# Altium schematic sheet PROBE 1 CYLINDERS.SchDoc: PROBE 1 CYLINDERS
size 558 x 401 mm; Organization: Carnegie Institution of Washington; DocumentNumber: 4; SheetNumber: 3; SheetTotal: 7; PageSetup: Record=PageOptions|CenterHorizontal=True|CenterVertical=True|PrintScale=0.68|XCorrection=1.00|YCorrection=1.00|PrintKind=0|BorderSize=5000000|LeftOffset=0|BottomOffset=0|Orientation=2|PaperLength=1000|PaperWidth=1000|Scale=100|PaperSource=15|PrintQuality=1200|MediaType=1|DitherType=10|PaperKind=11 x 17|PrintScaleMode=1; DocumentName: CYLINDERS
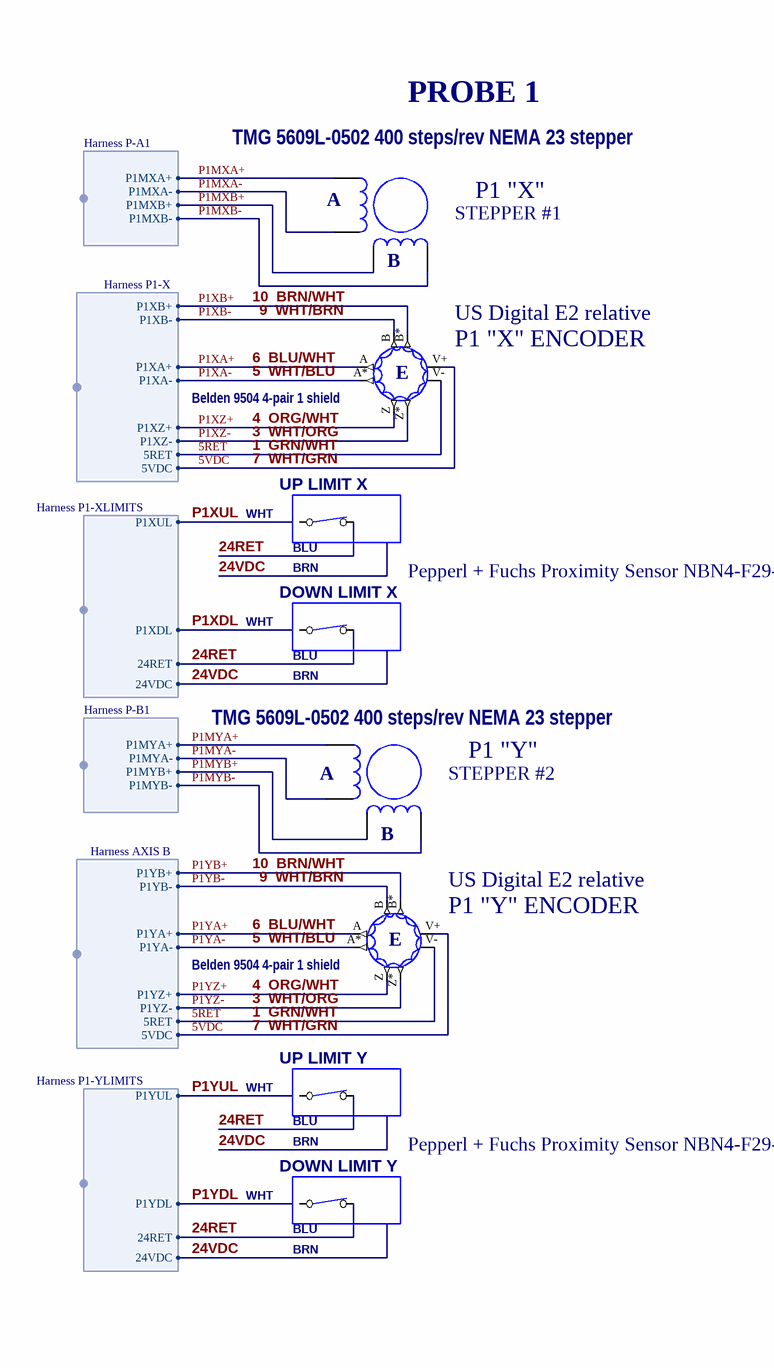
[diagram p0: PROBE 1 CYLINDERS.SchDoc, left]
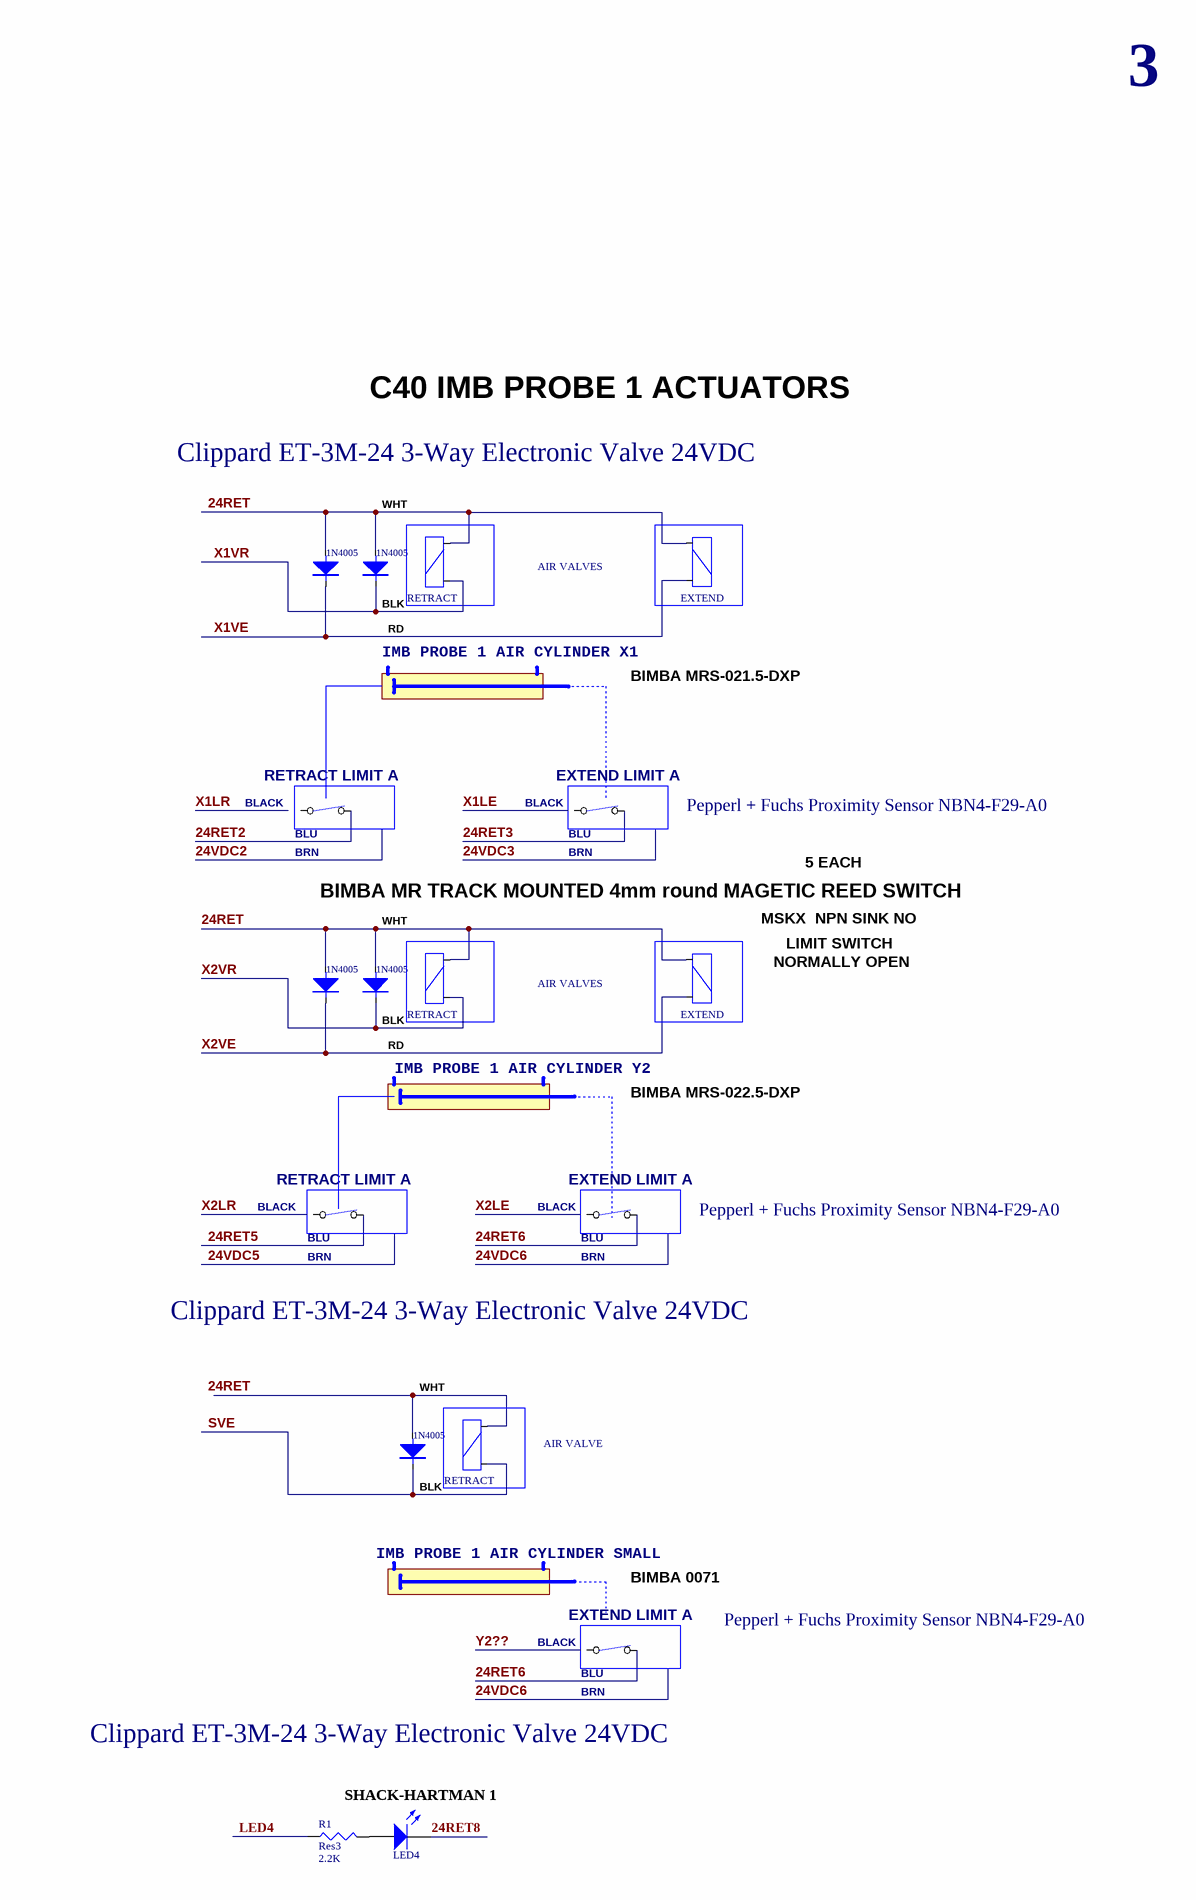
[diagram p1: PROBE 1 CYLINDERS.SchDoc, right]

## Parts
(Parts that share a designator on the sheet are numbered #1, #2 ... from top to bottom, then left to right.)
?#1  RETRACT
?#2  1N4005
?#3  1N4005
?#4  SW-NC2  (value not drawn)
?#5  SW-NC2  (value not drawn)
?#6  SW-NC2  (value not drawn)
?#7  SW-NC2  (value not drawn)
?#8  RETRACT
?#9  1N4005
?#10  1N4005
?#11  SW-NC2  (value not drawn)
?#12  SW-NC2  (value not drawn)
?#13  SW-NC2  (value not drawn)
?#14  RETRACT  S: AIR VALVE
?#15  1N4005
?#16  SW-NC2  (value not drawn)
?#17  SW-NC2  (value not drawn)
AIR_VALVES#1  EXTEND
AIR_VALVES#2  EXTEND
D?  LED4  [LED-0]
IMB_PROBE_1_AIR_CYLINDER_SMALL  (no value)
IMB_PROBE_1_AIR_CYLINDER_X1  (no value)
IMB_PROBE_1_AIR_CYLINDER_Y2  (no value)
P1_"X"  STEPPER #1
P1_"Y"  STEPPER #2
R1  Res3  value 2.2K  [J1-0603]
US_Digital_E2_relative#1  P1 "X" ENCODER
US_Digital_E2_relative#2  P1 "Y" ENCODER

## Harnesses
Harness P1-X: P1XB+, P1XB-, P1XA+, P1XA-, P1XZ+, P1XZ-, 5RET, 5VDC
Harness AXIS B: P1YB+, P1YB-, P1YA+, P1YA-, P1YZ+, P1YZ-, 5RET, 5VDC
Harness P1-XLIMITS: P1XUL, 24RET, 24VDC, P1XDL
Harness P1-YLIMITS: P1YUL, 24RET, 24VDC, P1YDL
Harness P-B1: P1MYA+, P1MYA-, P1MYB+, P1MYB-
Harness P-A1: P1MXA+, P1MXA-, P1MXB+, P1MXB-

## Nets
1  GRN/WHT: US_Digital_E2_relative#1.V- US_Digital_E2_relative#2.V- ; harness Harness P1-X.5RET, harness Harness AXIS B.5RET  [also labelled 5RET]
3  WHT/ORG: US_Digital_E2_relative#1.Z* US_Digital_E2_relative#2.Z* ; harness Harness P1-X.P1XZ-, harness Harness AXIS B.P1YZ-  [also labelled P1XZ-, P1YZ-]
4  ORG/WHT: US_Digital_E2_relative#1.Z US_Digital_E2_relative#2.Z ; harness Harness P1-X.P1XZ+, harness Harness AXIS B.P1YZ+  [also labelled P1XZ+, P1YZ+]
5  WHT/BLU: US_Digital_E2_relative#1.A* US_Digital_E2_relative#2.A* ; harness Harness P1-X.P1XA-, harness Harness AXIS B.P1YA-  [also labelled P1XA-, P1YA-]
5VDC: US_Digital_E2_relative#1.V+ US_Digital_E2_relative#2.V+ ; harness Harness P1-X.5VDC, harness Harness AXIS B.5VDC  [also labelled 7  WHT/GRN]
6  BLU/WHT: US_Digital_E2_relative#1.A US_Digital_E2_relative#2.A ; harness Harness P1-X.P1XA+, harness Harness AXIS B.P1YA+  [also labelled P1XA+, P1YA+]
9  WHT/BRN: US_Digital_E2_relative#1.B US_Digital_E2_relative#2.B ; harness Harness P1-X.P1XB-, harness Harness AXIS B.P1YB-  [also labelled P1XB-, P1YB-]
10  BRN/WHT: US_Digital_E2_relative#1.B* US_Digital_E2_relative#2.B* ; harness Harness P1-X.P1XB+, harness Harness AXIS B.P1YB+  [also labelled P1XB+, P1YB+]
24RET: ?#1.10(-) ?#2.1(A) ?#3.1(A) ?#6.2 ?#7.2 ?#8.10(-) ?#9.1(A) ?#10.1(A) ?#13.2 ?#16.2 AIR_VALVES#1.10(-) AIR_VALVES#2.10(-) ; harness Harness P1-XLIMITS.24RET, harness Harness P1-YLIMITS.24RET
24RET2: ?#4.2
24RET3: ?#5.2
24RET5: ?#11.2
24RET6: ?#12.2 ?#17.2
24RET8: D?.2(K)
24VDC: harness Harness P1-XLIMITS.24VDC, harness Harness P1-YLIMITS.24VDC
LED4: R1.1
P1MXA+: P1_"X".1 ; harness Harness P-A1.P1MXA+
P1MXA-: P1_"X".3 ; harness Harness P-A1.P1MXA-
P1MXB+: P1_"X".4 ; harness Harness P-A1.P1MXB+
P1MXB-: P1_"X".6 ; harness Harness P-A1.P1MXB-
P1MYA+: P1_"Y".1 ; harness Harness P-B1.P1MYA+
P1MYA-: P1_"Y".3 ; harness Harness P-B1.P1MYA-
P1MYB+: P1_"Y".4 ; harness Harness P-B1.P1MYB+
P1MYB-: P1_"Y".6 ; harness Harness P-B1.P1MYB-
P1XDL: harness Harness P1-XLIMITS.P1XDL
P1XUL: harness Harness P1-XLIMITS.P1XUL
P1YDL: harness Harness P1-YLIMITS.P1YDL
P1YUL: harness Harness P1-YLIMITS.P1YUL
SVE: ?#14.2(+) ?#15.2(K)
X1VE: ?#2.2(K) AIR_VALVES#1.2(+)
X1VR: ?#1.2(+) ?#3.2(K)
X2VE: ?#9.2(K) AIR_VALVES#2.2(+)
X2VR: ?#8.2(+) ?#10.2(K)
Net?#14_10: ?#14.10(-) ?#15.1(A)
NetD?_1: D?.1(A) R1.2

Not connected (* = marked no-connect by the designer): ?#4 1; ?#5 1; ?#6 1; ?#7 1; ?#11 1; ?#12 1; ?#13 1; ?#16 1; ?#17 1

## Notes on the sheet
- 3
- C40 IMB PROBE 1 ACTUATORS
- PROBE 1
- Clippard ET-3M-24 3-Way Electronic Valve 24VDC
- (near P1_"X") TMG 5609L-0502 400 steps/rev NEMA 23 stepper
- WHT
- (near P1_"X") A
- BLK
- (near P1_"X") B
- RD
- BIMBA MRS-021.5-DXP
- (near US_Digital_E2_relative#1) Belden 9504 4-pair 1 shield
- RETRACT LIMIT A
- EXTEND LIMIT A
- UP LIMIT X
- BLACK
- BLU
- BRN
- Pepperl + Fuchs Proximity Sensor NBN4-F29-A0
- BIMBA MR TRACK MOUNTED 4mm round MAGETIC REED SWITCH
- 5 EACH
- DOWN LIMIT X
- MSKX  NPN SINK NO
- NORMALLY OPEN
- LIMIT SWITCH
- (near P1_"Y") TMG 5609L-0502 400 steps/rev NEMA 23 stepper
- (near P1_"Y") A
- BIMBA MRS-022.5-DXP
- (near P1_"Y") B
- (near US_Digital_E2_relative#2) Belden 9504 4-pair 1 shield
- UP LIMIT Y
- DOWN LIMIT Y
- BIMBA 0071
- SHACK-HARTMAN 1
- Labels drawn without touching a wire or pin: 24RET
- Carnegie Institution of Washington
- 813 Santa Barbara Street
- The Observatories
- PHONE (626) 577-1122               FAX (626) 795-8136
- Pasadena, California 91101
- Title:
- OCIW
- Size:
- Date:
- C
- Scale:
- Drawn By:
- Checked By:
- A. BAGISH
- alanb
- Revision:
- Sheet          of
- File:
- (in symbol ENCODER DIF) E

## Library data of the parts
?#1 ?#8 ?#14 AIR_VALVES#1 AIR_VALVES#2 = COIL2
?#2 ?#3 ?#9 ?#10 ?#15 = DIODE(SHORT)
D? = LED0: Typical INFRARED GaAs LED; Manuf #: 607-1212-120F; Published: 8-Jun-2000; LatestRevisionDate: 08-Jul-2005; LatestRevisionNote: Mech Layer 1 removed.; PackageReference: LED-0; Publisher: Altium Limited
IMB_PROBE_1_AIR_CYLINDER_SMALL IMB_PROBE_1_AIR_CYLINDER_X1 IMB_PROBE_1_AIR_CYLINDER_Y2 = AIR CYL LONG IN
P1_"X" P1_"Y" = MOTOR STEPPER
R1 = Res3: Resistor; Published: 8-Jun-2000; LatestRevisionDate: 04-Mar-2005; LatestRevisionNote: PCB Footprint replaced.; PackageReference: J1-0603; Publisher: Altium Limited
US_Digital_E2_relative#1 US_Digital_E2_relative#2 = ENCODER DIF